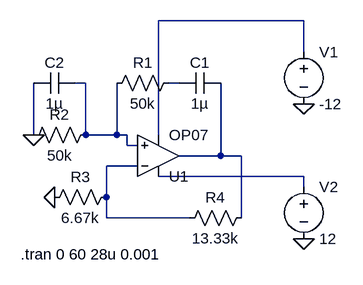
[diagram p0: schematic Az4.asc]
Az4.asc, the LTspice schematic file:
Version 4
SHEET 1 880 680
WIRE 400 -32 176 -32
WIRE 400 16 400 -32
WIRE 64 64 48 64
WIRE 208 64 192 64
WIRE -16 144 -16 64
WIRE 64 144 64 64
WIRE 112 144 112 64
WIRE 112 144 64 144
WIRE 128 144 112 144
WIRE 176 144 176 -32
WIRE 128 160 128 144
WIRE 144 160 128 160
WIRE 272 176 272 64
WIRE 272 176 208 176
WIRE 304 176 272 176
WIRE 144 192 96 192
WIRE 400 208 176 208
WIRE 400 224 400 208
WIRE 96 240 96 192
WIRE 96 272 96 240
WIRE 224 272 96 272
WIRE 304 272 304 176
FLAG -16 144 0
FLAG 16 240 0
FLAG 400 304 0
FLAG 400 96 0
SYMBOL OpAmps\\OP07 176 240 M180
SYMATTR InstName U1
SYMBOL res 208 48 R90
WINDOW 0 0 56 VBottom 2
WINDOW 3 32 56 VTop 2
SYMATTR InstName R1
SYMATTR Value 50k
SYMBOL res 80 128 R90
WINDOW 0 0 56 VBottom 2
WINDOW 3 32 56 VTop 2
SYMATTR InstName R2
SYMATTR Value 50k
SYMBOL res 112 224 R90
WINDOW 0 0 56 VBottom 2
WINDOW 3 32 56 VTop 2
SYMATTR InstName R3
SYMATTR Value 6.67k
SYMBOL res 320 256 R90
WINDOW 0 0 56 VBottom 2
WINDOW 3 32 56 VTop 2
SYMATTR InstName R4
SYMATTR Value 13.33k
SYMBOL cap 272 48 R90
WINDOW 0 0 32 VBottom 2
WINDOW 3 32 32 VTop 2
SYMATTR InstName C1
SYMATTR Value 1µ
SYMATTR SpiceLine IC=2
SYMBOL cap 48 48 R90
WINDOW 0 0 32 VBottom 2
WINDOW 3 32 32 VTop 2
SYMATTR InstName C2
SYMATTR Value 1µ
SYMATTR SpiceLine IC=2
SYMBOL voltage 400 0 R0
WINDOW 123 0 0 Left 0
WINDOW 39 0 0 Left 0
SYMATTR InstName V1
SYMATTR Value -12
SYMBOL voltage 400 208 R0
WINDOW 123 0 0 Left 0
WINDOW 39 0 0 Left 0
SYMATTR InstName V2
SYMATTR Value 12
TEXT -36 328 Left 2 !.tran 0 60 28u 0.001

The netlist it stands for:
* Az4.asc
XU1 N002 N005 N006 N001 N004 LT1001  ; OP07, pins In+ In- V+ V- OUT
R1 N003 N002 50k
R2 N002 0 50k
R3 N005 0 6.67k
R4 N004 N005 13.33k
C1 N004 N003 1µ IC=2
C2 N002 0 1µ IC=2
V1 N001 0 -12
V2 N006 0 12
.tran 0 60 28u 0.001
.lib LTC.lib
.backanno
.end